# EAGLE design FremoLNShield (EAGLE 7.6.0)
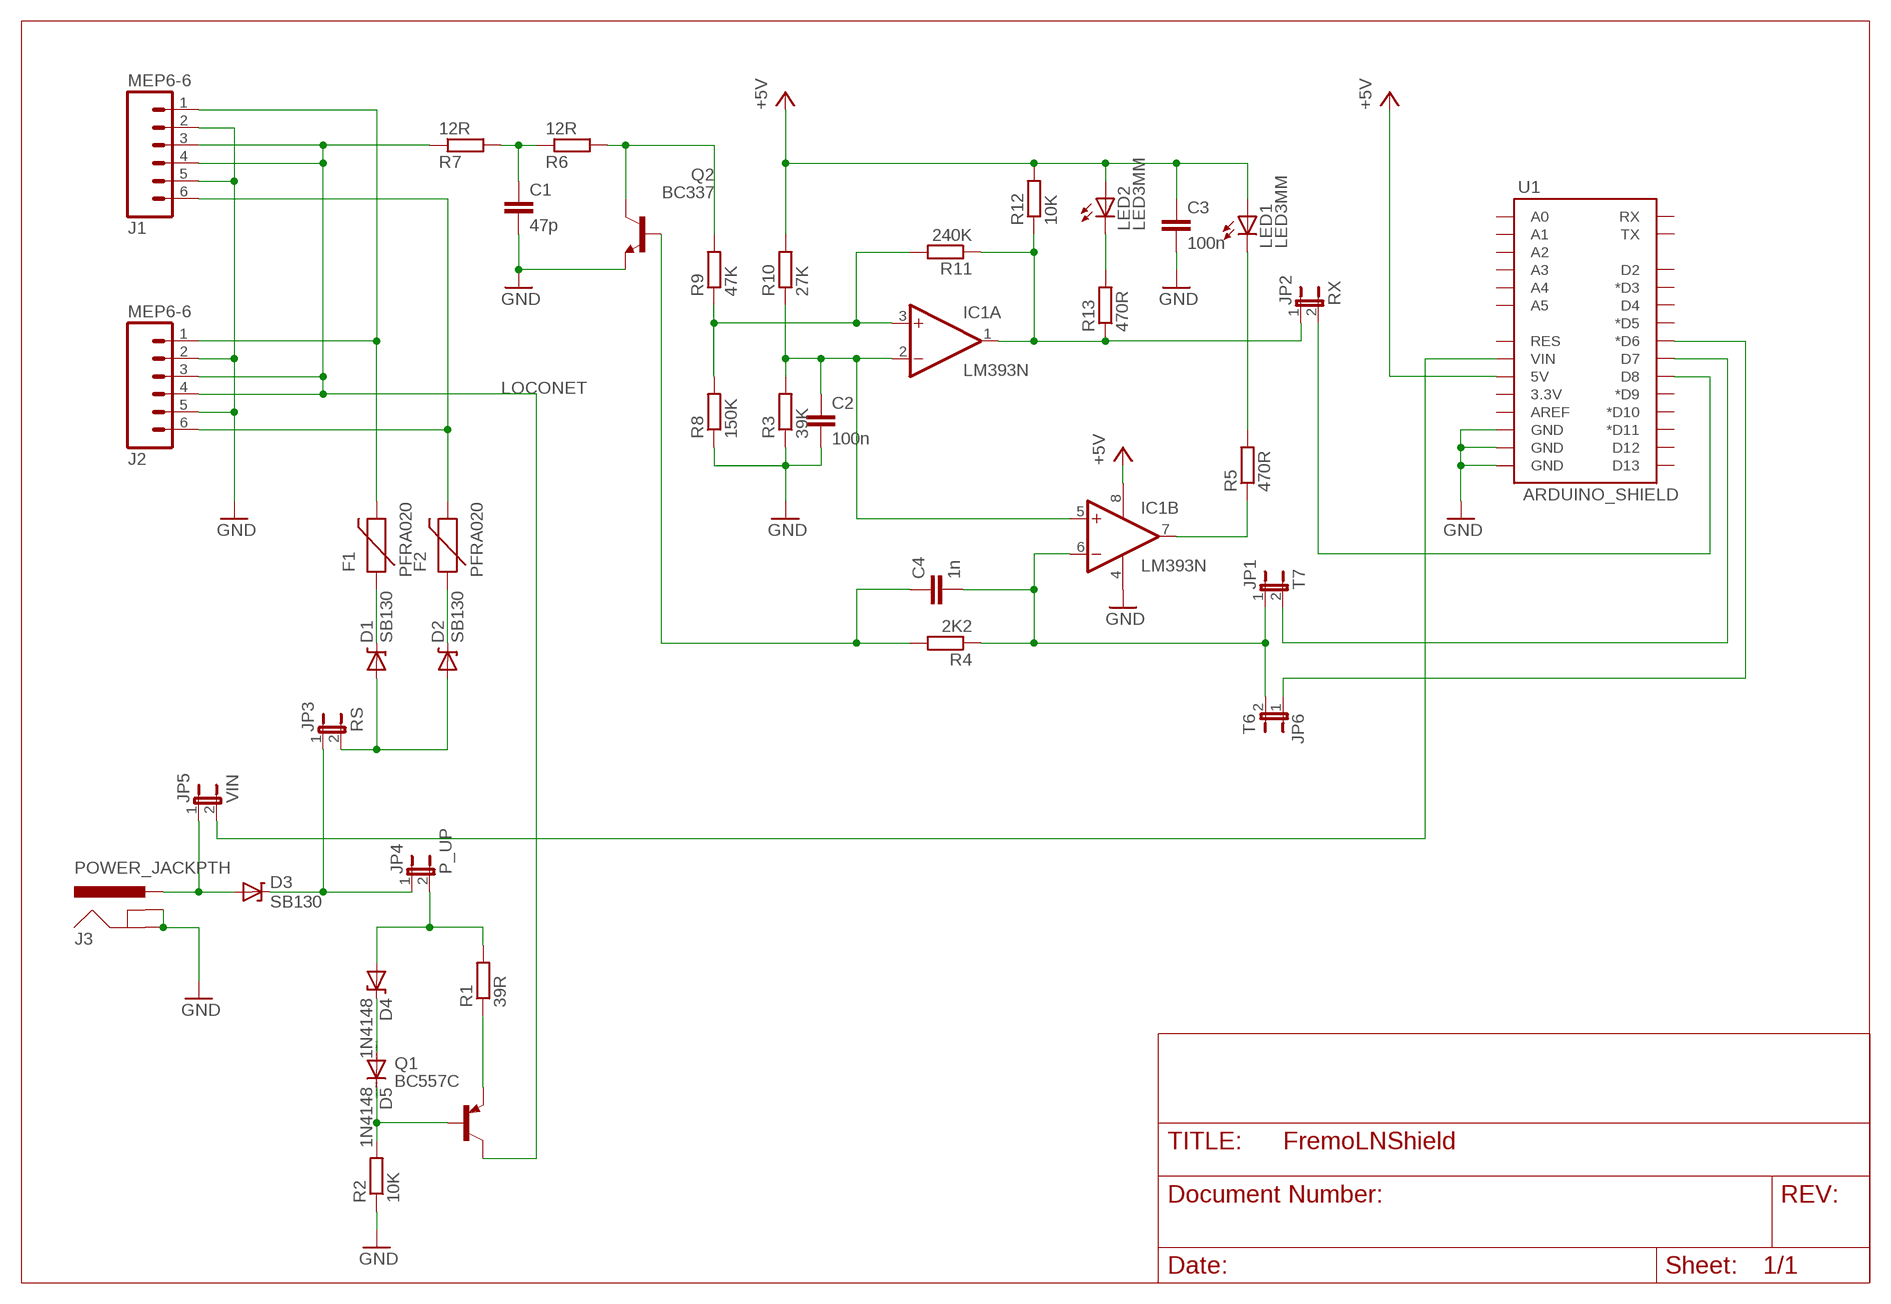
[diagram p0: schematic, sheet 1]

## Parts
C1  47p  C-EU025-025X050  [C025-025X050]
C2  100n  C-EU025-025X050  [C025-025X050]
C3  100n  C-EU025-025X050  [C025-025X050]
C4  1n  C-EU025-025X050  [C025-025X050]
D1  SB130  DIODE-ZENERPTH  [DIODE-ZENER]
D2  SB130  DIODE-ZENERPTH  [DIODE-ZENER]
D3  SB130  DIODE-ZENERPTH  [DIODE-ZENER]
D4  1N4148  DIODE-ZENERPTH  [DIODE-ZENER]
D5  1N4148  1N4148DO35-10  [DO35-10]
F1  PFRA020  PTCPTH  [PTC]
F2  PFRA020  PTCPTH  [PTC]
IC1  LM393N  [DIL08]
J1  MEP6-6  RJ11-6PTH  [RJ11-6]
J2  MEP6-6  RJ11-6PTH  [RJ11-6]
J3  POWER_JACKPTH  [POWER_JACK_PTH]
JP1  T7  JUMPER-2PTH  [1X02]
JP2  RX  JUMPER-2PTH  [1X02]
JP3  RS  JUMPER-2PTH  [1X02]
JP4  P_UP  JUMPER-2PTH  [1X02]
JP5  VIN  JUMPER-2PTH  [1X02]
JP6  T6  JUMPER-2PTH  [1X02]
LED1  LED3MM  PFEIL3_LED3MM  [PFEIL3_LED3MM]
LED2  LED3MM  PFEIL3_LED3MM  [PFEIL3_LED3MM]
Q1  BC557C  BC557  [TO92]
Q2  BC337  [TO92]
R1  39R  R-EU_0207/10  [0207/10]
R2  10K  R-EU_0207/10  [0207/10]
R3  39K  R-EU_0207/10  [0207/10]
R4  2K2  R-EU_0207/10  [0207/10]
R5  470R  R-EU_0207/10  [0207/10]
R6  12R  R-EU_0207/10  [0207/10]
R7  12R  R-EU_0207/10  [0207/10]
R8  150K  R-EU_0207/10  [0207/10]
R9  47K  R-EU_0207/10  [0207/10]
R10  27K  R-EU_0207/10  [0207/10]
R11  240K  R-EU_0207/10  [0207/10]
R12  10K  R-EU_0207/10  [0207/10]
R13  470R  R-EU_0207/10  [0207/10]
U1  ARDUINO_SHIELD  ARDUINO_SHIELDLABEL  [DUEMILANOVE_SHIELD]

## Nets
GND: C1.2 C2.2 C3.2 IC1.4(P:V-) J1.2 J1.5 J2.2 J2.5 J3.GND J3.GNDBREAK Q2.1(E) R2.1 R3.1 R8.1 U1.GND@0(GND) U1.GND@1(GND) U1.GND@2(GND)
LN_RX: IC1.1(A:OUT) JP2.1 R11.1 R12.1 R13.1
LN_TX: C4.2 IC1.6(B:-IN) JP1.1 JP6.2 R4.1
LOCONET: J1.3 J1.4 J2.3 J2.4 Q1.3(C) R7.1
N$1: D3.P$2(A) J3.PWR JP5.1
N$2: D3.P$1(C) JP3.1 JP4.1
N$3: D1.P$1(C) F1.P$1
N$4: D2.P$1(C) F2.P$1
N$5: F1.P$2 J1.1 J2.1
N$6: D4.P$2(A) JP4.2 R1.2
N$7: F2.P$2 J1.6 J2.6
N$8: D4.P$1(C) D5.A
N$9: D5.C Q1.2(B) R2.2
N$10: C2.1 IC1.2(A:-IN) IC1.5(B:+IN) R3.2 R10.1
N$11: Q1.1(E) R1.1
N$12: C4.1 Q2.2(B) R4.2
N$13: C1.1 R6.1 R7.2
N$14: D1.P$2(A) D2.P$2(A) JP3.2
N$15: JP2.2 U1.D8
N$16: Q2.3(C) R6.2 R9.2
N$17: IC1.3(A:+IN) R8.2 R9.1 R11.2
N$18: JP1.2 U1.D7
N$19: IC1.7(B:OUT) R5.1
N$20: LED2.K(C) R13.2
N$21: LED1.K(C) R5.2
N$22: JP6.1 U1.D6(*D6)
VCC: C3.1 IC1.8(P:V+) LED1.A LED2.A R10.2 R12.2 U1.5V ; supply symbol labelled +5V
VIN: JP5.2 U1.VIN
Unconnected: U1.3.3V U1.A0 U1.A1 U1.A2 U1.A3 U1.A4 U1.A5 U1.AREF U1.D2 U1.D3(*D3) U1.D4 U1.D5(*D5) U1.D9(*D9) U1.D10(*D10) U1.D11(*D11) U1.D12 U1.D13 U1.RES U1.RX U1.TX

## Library data of the parts
C1-C4 = rcl:C-EU: CAPACITOR, European symbol
D1-D4 = SparkFun-DiscreteSemi:DIODE-ZENER: Zener Diode Production Part - 8199 3.4V Zener Voltage
D5 = diode:1N4148: DIODE high speed (Philips)
F1 F2 = SparkFun-PowerIC:PTC: Resettable Fuse PTC Resettable Fuse. Spark Fun Electronics SKU : COM-08357
IC1 = linear:LM393: COMPARATOR
J1 J2 = SparkFun-Connectors:RJ11-6: RJ11 Jack Simple 6 pin RJ11 jack. Commonly found on CAT3 devices and Microchip programmers. SKU: PRT-00132
J3 = SparkFun-Connectors:POWER_JACK: Power Jack This is the standard 5.5mm barrel jack for power. The PTH is the most common, proven, reliable, footprint. The Slot footprint only works if the mill layer is transmitted to the PCB fab house so be warned. Mating wall wart : TOL-00298 (and others); PROD_ID: PRT-00119
JP1-JP6 = SparkFun-Passives:JUMPER-2: Jumper Basic 0.1" spaced jumper. Use with breakaway headers.
LED1 LED2 = _relaisblock2Gl-Frontplatte:PFEIL3_LED: LED LED, einzeln, verschiedene Bauformen
Q1 = transistor-pnp:BC557: PNP Transistor
Q2 = transistor-npn:BC337*: NPN Transistor
R1-R13 = rcl:R-EU_: RESISTOR, European symbol
U1 = SparkFun-Boards:ARDUINO_SHIELD: Arduino shield footprint

## Net classes
2 gnd: width 0.305 mm, drill 0.508 mm, clearance 0.152 mm
3 usbvcc: width 0.508 mm, drill 0.508 mm, clearance 0.152 mm

## Board
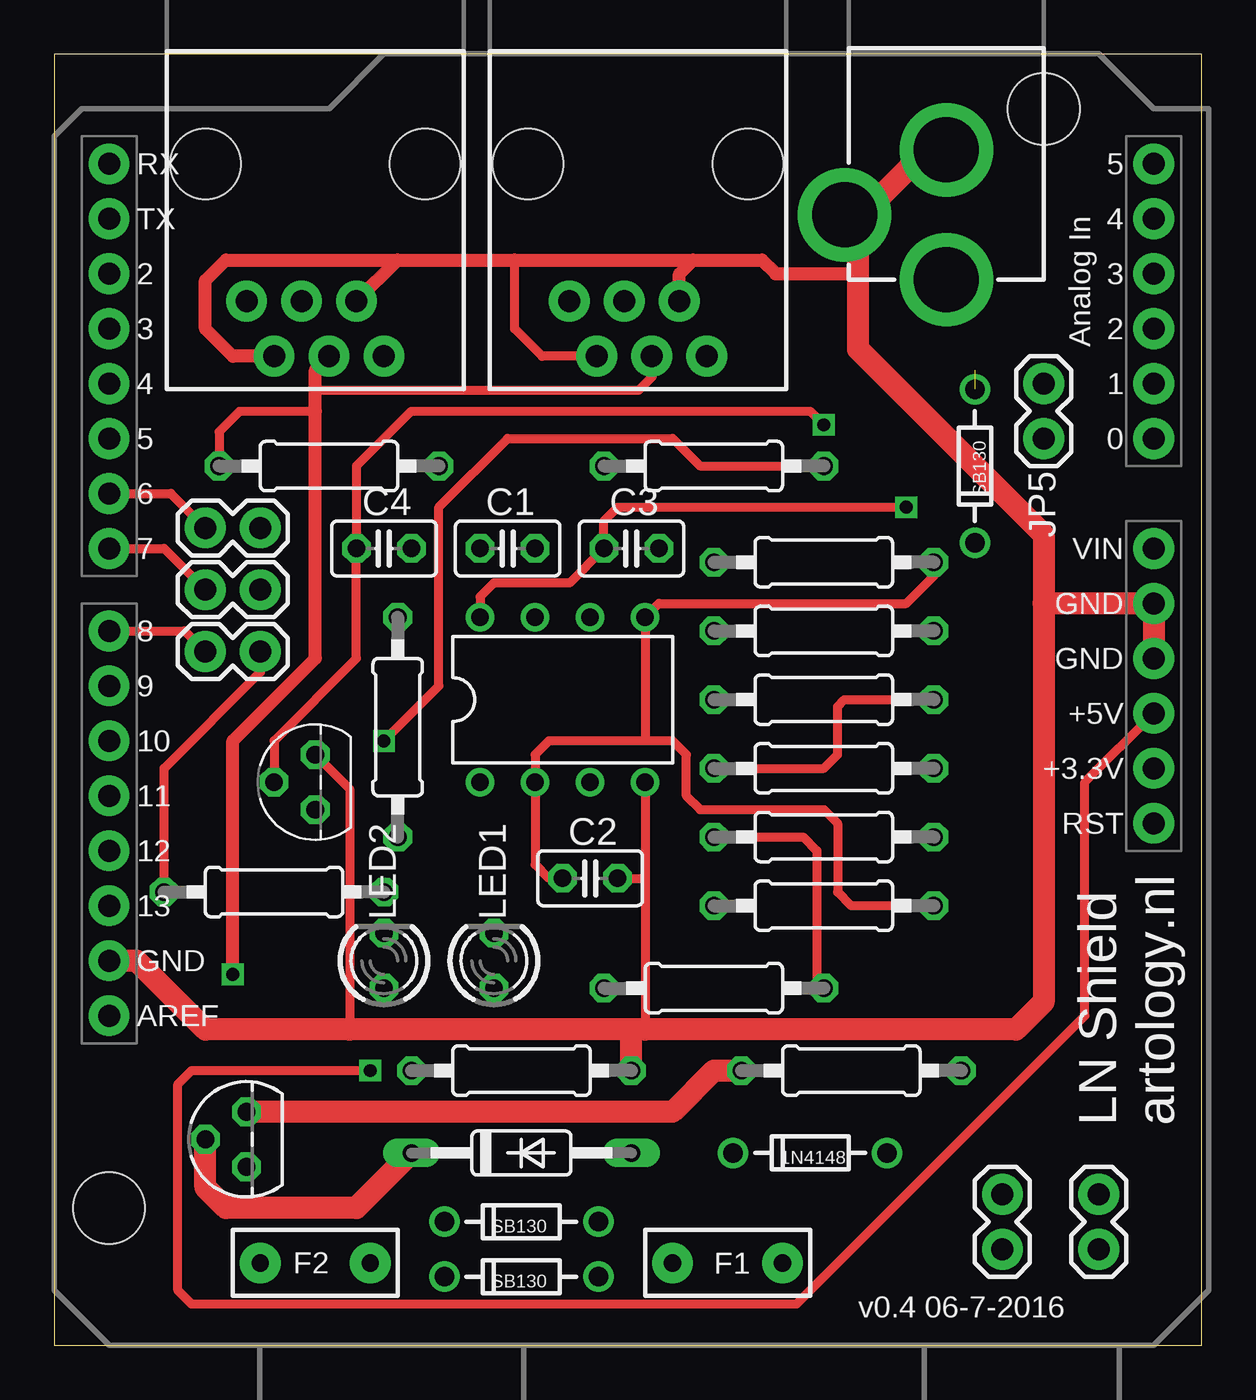
[diagram p1: board, top side]
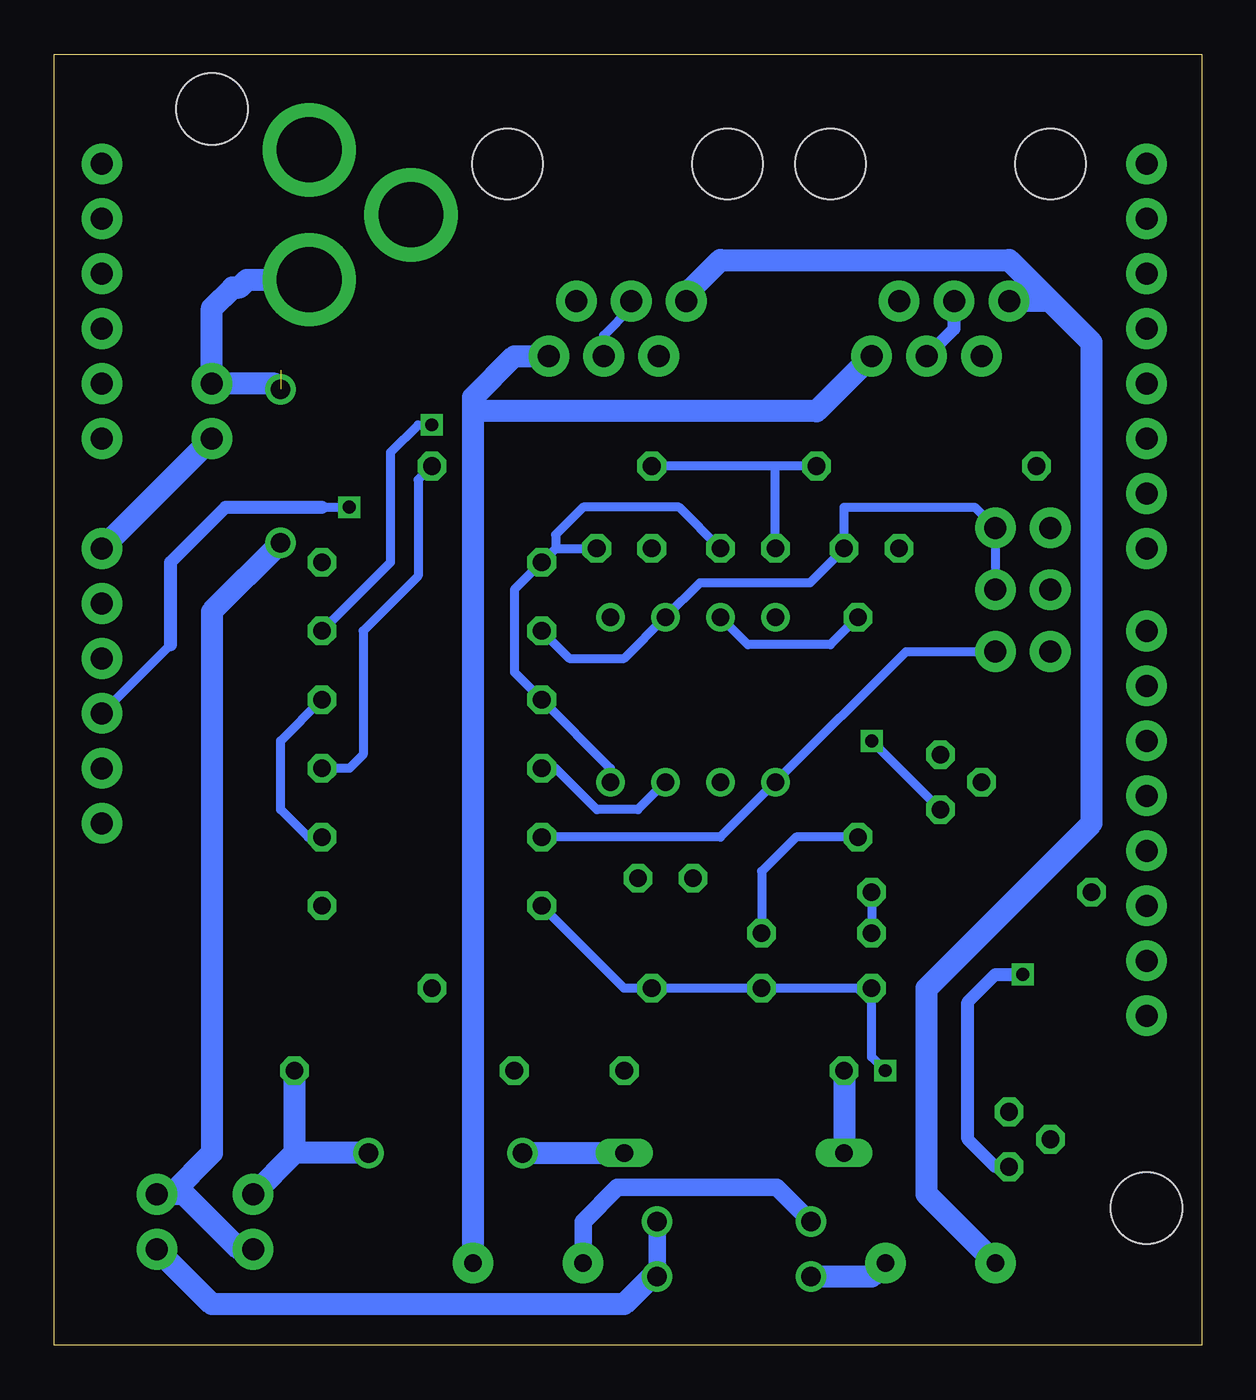
[diagram p2: board, bottom side, seen from below]

Size 53.01 x 59.68 mm. Coordinates in mm from the lower left corner, seen from the top.
Outline: 0,0 53.01,0 53.01,59.68 0,59.68 0,0
Copper layers (1*16): Top 0.035mm / dielectric 1.5mm / Bottom 0.035mm
Design rules "default": minimum track width 10mil, minimum drill 24mil, track to track 8mil, track to pad 8mil, pad to pad 8mil, via to via 8mil, smd to smd 8mil, copper to edge 40mil, drill to drill 8mil, minimum pad ring 10mil, minimum via ring 8mil, stop-mask expansion 4mil, vias tented up to drill 0mil, thermal gap 10mil

### Footprints (pad centres in the part's own frame; a part is rotated, then mirrored left to right if it is on the bottom)
C025-025X050 = drill 0.813 octagon: 1 -1.27,0; 2 1.27,0
DIODE-ZENER = drill 0.9: P$1 -3.556,0; P$2 3.556,0
DO35-10 = drill 0.813 long: A 5.08,0; C -5.08,0
PTC = drill 0.8 pad 1.88: P$1 -2.54,0; P$2 2.54,0
DIL08 = drill 0.813 pad 1.27: 1 -3.81,-3.81; 2 -1.27,-3.81; 3 1.27,-3.81; 4 3.81,-3.81; 5 3.81,3.81; 6 1.27,3.81; 7 -1.27,3.81; 8 -3.81,3.81
RJ11-6 = drill 1.016 pad 1.88: 1 1.905,8.89; 2 3.175,6.35; 3 4.445,8.89; 4 5.715,6.35; 5 6.985,8.89; 6 8.255,6.35 | hole 3.251: 0,0; 10.16,0
POWER_JACK_PTH = drill 2.997 pad 4.318: GND 0,7.7; GNDBREAK 4.7,10.7; PWR 0,13.7
1X02 = drill 1.016 pad 1.88: 1 0,0; 2 2.54,0
PFEIL3_LED3MM = drill 0.813 octagon: A -1.27,0; K 1.27,0
TO92 = drill 0.813 octagon: 1 1.27,0; 2 0,1.905; 3 -1.27,0
0207/10 = drill 0.813 octagon: 1 -5.08,0; 2 5.08,0
DUEMILANOVE_SHIELD = drill 1.016 pad 1.88: 3.3V 50.8,26.67; 5V 50.8,29.21; A0 50.8,41.91; A1 50.8,44.45; A2 50.8,46.99; A3 50.8,49.53; A4 50.8,52.07; A5 50.8,54.61; AREF 2.54,15.24; D2 2.54,49.53; D3 2.54,46.99; D4 2.54,44.45; D5 2.54,41.91; D6 2.54,39.37; D7 2.54,36.83; D8 2.54,33.02; D9 2.54,30.48; D10 2.54,27.94; D11 2.54,25.4; D12 2.54,22.86; D13 2.54,20.32; GND@0 50.8,31.75; GND@1 50.8,34.29; GND@2 2.54,17.78; RES 50.8,24.13; RX 2.54,54.61; TX 2.54,52.07; VIN 50.8,36.83 | hole 3.302: 45.72,57.15; 2.54,6.35

### Placement (x,y rotation side)
C1  20.96,36.83 0 top
C2  24.77,21.59 0 top
C3  26.67,36.83 0 top
C4  15.24,36.83 0 top
D1  21.59,5.71 0 top
D2  21.59,3.18 0 top
D3  42.54,40.64 90 top
D4  34.92,8.89 0 top
D5  21.59,8.89 0 top
F1  31.11,3.81 0 top
F2  12.07,3.81 180 top
IC1  23.5,29.84 0 top
J1  17.14,54.61 180 top
J2  32.06,54.61 180 top
J3  41.22,62.95 180 top
JP1  9.53,34.92 180 top
JP2  9.53,32.07 180 top
JP3  48.26,6.99 270 top
JP4  43.81,4.45 90 top
JP5  45.72,44.45 270 top
JP6  6.99,37.78 0 top
LED1  20.32,17.78 90 top
LED2  15.24,17.78 90 top
Q1  8.89,9.53 90 top
Q2  12.07,26.04 90 top
R1  36.83,12.7 0 top
R2  21.59,12.7 180 top
R3  35.56,36.2 0 top
R4  35.56,33.02 0 top
R5  15.88,28.57 270 top
R6  30.48,40.64 0 top
R7  12.7,40.64 0 top
R8  35.56,29.84 0 top
R9  35.56,26.67 0 top
R10  35.56,20.32 180 top
R11  35.56,23.5 0 top
R12  30.48,16.51 180 top
R13  10.16,20.96 0 top
U1  0,0 0 top

### Tracks (layer width: path | path; a pad name or v marks a point on that pad's centre or on a via)
GND
  Top 0.406: IC1.4 27.3,21.59 | 27.3,21.59 27.3,14.61 | J2.5 22.54,45.72 21.27,46.99 21.27,50.16 | Q2.1 13.65,25.72 13.65,14.61 | 37.15,52.07 36.71,52.07 J3.GNDBREAK | C2.2 27.3,21.59
  Top 0.61: J1.2 15.88,50.16 | 15.88,50.16 21.27,50.16 29.53,50.16 | 29.53,50.16 32.7,50.16 33.34,49.53 37.15,49.53 | J2.2 28.88,49.52 29.53,50.16 | J1.5 8.26,45.72 6.99,46.99 6.99,49.21 7.94,50.16 15.88,50.16
  Top 1.016: U1.GND@0 U1.GND@1 45.72,34.29 | 45.72,34.29 45.72,37.46 37.15,46.04 37.15,49.53 37.15,52.07 40.33,55.25 J3.GND | 45.72,34.29 45.72,15.88 44.45,14.61 27.3,14.61 26.67,14.61 | 26.67,14.61 13.65,14.61 6.99,14.61 3.81,17.78 U1.GND@2 | R2.1 26.67,14.61
  Bottom 0.406: IC1.4 27.3,26.67 R8.1 31.75,31.11 31.75,34.92 R3.1 29.84,36.83 | 29.84,36.83 C3.2 | C1.2 24.13,38.73 28.57,38.73 29.84,37.46 29.84,36.83
LN_RX
  Top 0.406: R11.1 34.61,23.5 35.24,22.86 35.24,16.83 R12.1 | R13.1 5.08,26.67 9.53,31.11 JP2.1
  Bottom 0.406: R11.1 22.23,23.5 IC1.1 13.65,32.07 JP2.1
LN_TX
  Bottom 0.406: R4.1 29.21,31.75 26.67,31.75 IC1.6 23.18,35.24 18.1,35.24 C4.2 16.51,38.73 10.48,38.73 JP6.2 JP1.1
LOCONET  (via drill 0.6)
  Top 0.406: 12.07,43.18 8.57,43.18 7.62,42.23 R7.1 | 12.07,44.13 26.99,44.13 27.61,44.76 J2.3
  Top 0.61: v8.26,17.14 8.26,27.94 12.07,31.75 12.07,43.18 12.07,44.13 12.07,45.08 J1.3
  Bottom 0.406: J2.4 26.34,47.95 27.62,46.67 27.62,45.73 J2.3
  Bottom 0.61: Q1.3 9.53,8.26 10.79,9.53 10.79,15.88 9.53,17.14 v8.26,17.14 | J1.3 11.43,46.99 J1.4
N$1  (1 unrouted)
  Bottom 1.016: J3.PWR 44.09,49.25 44.45,48.89 44.77,48.89 45.72,47.94 JP5.1 42.8,44.45 D3.P$2
N$2
  Bottom 1.016: D3.P$1 45.72,33.91 45.72,8.89 47.62,6.99 | JP4.1 44.45,4.45 46.99,6.99 47.62,6.99 | 47.62,6.99 JP3.1
N$3
  Bottom 0.813: F1.P$1 28.57,5.71 26.99,7.3 19.62,7.3 D1.P$1
N$4
  Bottom 1.016: F2.P$1 15.24,3.18 D2.P$1
N$5
  Bottom 1.016: F1.P$2 33.65,43.18 | 33.65,43.18 33.65,43.81 31.75,45.72 J2.1 | J1.1 17.78,43.18 33.65,43.18
N$6
  Bottom 1.016: R1.2 41.91,8.89 | 41.91,8.89 JP4.2 | D4.P$2 41.91,8.89
N$7
  Bottom 1.016: 6.99,48.26 5.08,46.35 5.08,24.13 12.7,16.51 12.7,6.99 F2.P$2 | 6.99,48.26 J1.6 | 6.99,48.26 8.89,50.16 22.23,50.16 23.8,48.59 J2.6
N$8
  Bottom 1.016: D4.P$1 D5.A
N$9
  Top 1.016: D5.C 13.97,6.35 7.94,6.35 6.99,7.3 Q1.2
  Bottom 1.016: R2.2 D5.C
N$10
  Top 0.406: R3.2 40.64,35.56 39.37,34.29 27.94,34.29 IC1.5 27.3,27.94 | R10.1 36.83,20.32 36.2,20.96 36.2,24.13 35.56,24.77 29.84,24.77 29.21,25.4 29.21,27.3 28.57,27.94 27.3,27.94 | 27.3,27.94 22.86,27.94 22.23,27.3 IC1.2 22.23,22.23 22.86,21.59 C2.1
N$11
  Top 1.016: Q1.1 28.57,10.79 30.48,12.7 R1.1
N$12  (via drill 0.6)
  Top 0.406: v35.56,42.54 34.92,43.18 16.51,43.18 13.97,40.64 C4.1 13.97,31.75 10.16,27.94 Q2.2
  Bottom 0.406: R4.2 37.46,36.2 37.46,41.27 36.2,42.54 v35.56,42.54
N$13
  Bottom 0.406: R7.2 19.68,40.64 | 19.68,40.64 R6.1 | C1.1 19.68,40.64
N$14
  Bottom 0.813: D2.P$2 D1.P$2
  Bottom 1.016: D2.P$2 25.4,3.18 26.67,1.9 45.72,1.9 JP3.2
N$15
  Top 0.406: U1.D8 6.03,33.02 JP2.2
N$16  (via drill 0.6)
  Top 0.406: v15.24,27.94 17.78,30.48 17.78,38.73 20.96,41.91 28.57,41.91 29.84,40.64 R6.2
  Bottom 0.406: R9.2 39.37,26.67 38.73,27.3 38.73,33.02 36.2,35.56 36.2,40 R6.2 | Q2.3 v15.24,27.94
N$17
  Top 0.406: R9.1 35.56,26.67 36.2,27.3 36.2,29.53 36.51,29.84 R8.2
  Bottom 0.406: R8.2 42.54,27.94 42.54,24.77 41.27,23.5 R11.2 | IC1.3 26.04,24.77 27.94,24.77 29.84,26.67 R9.1
N$18
  Top 0.406: U1.D7 5.08,36.83 JP1.2
N$19
  Bottom 0.406: R5.1 17.14,32.38 20.96,32.38 IC1.7
N$20
  Bottom 0.406: R13.2 LED2.K
N$21
  Bottom 0.406: R5.2 18.73,23.5 20.32,21.91 LED1.K
N$22
  Top 0.406: U1.D6 5.4,39.37 JP6.1
VCC  (via drill 0.6)
  Top 0.406: v14.61,12.7 6.35,12.7 5.71,12.07 5.71,2.54 6.35,1.9 34.29,1.9 47.62,15.24 47.62,26.04 U1.5V | IC1.8 19.68,34.61 20.32,35.24 23.81,35.24 C3.1 25.4,38.1 26.04,38.73 v39.37,38.73
  Bottom 0.406: 40.64,38.73 v39.37,38.73 | v14.61,12.7 15.24,13.34 15.24,15.88 15.88,16.51 LED2.A LED1.A R12.2 26.67,16.51 R10.2 | 47.62,32.38 U1.5V
  Bottom 0.61: 47.62,32.38 47.62,36.2 45.08,38.73 40.64,38.73
VIN
  Bottom 1.016: JP5.2 U1.VIN

### Text on the board
tPlace: LN Shield / artology.nl | v0.4 06-7-2016